# EAGLE design DSPC01_01 (EAGLE 6.5.0)
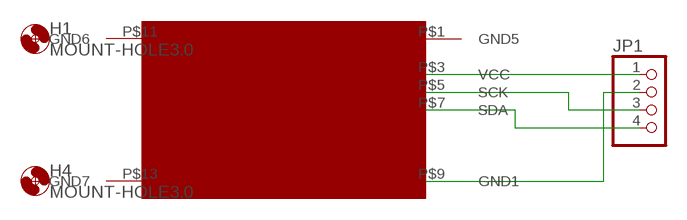
[diagram p0: schematic, sheet 1]

## Parts
H1  MOUNT-HOLE3.0  [3,0]
H4  MOUNT-HOLE3.0  [3,0]
JP1  PINHD-1X4/90  [1X04/90]
U$1  DSPC01  [DSPC01]

## Nets
N$1: JP1.2 U$1.P$9(GND1)
N$2: JP1.1 U$1.P$3(VCC)
N$3: JP1.3 U$1.P$5(SCK)
N$4: JP1.4 U$1.P$7(SDA)
Unconnected: U$1.P$1(GND5) U$1.P$11(GND6) U$1.P$13(GND7)

## Library data of the parts
H1 H4 = holes:MOUNT-HOLE: MOUNTING HOLE with drill center marker
JP1 = pinhead:PINHD-1X4: PIN HEADER
U$1 = DSPC01:DSPC01

## Board
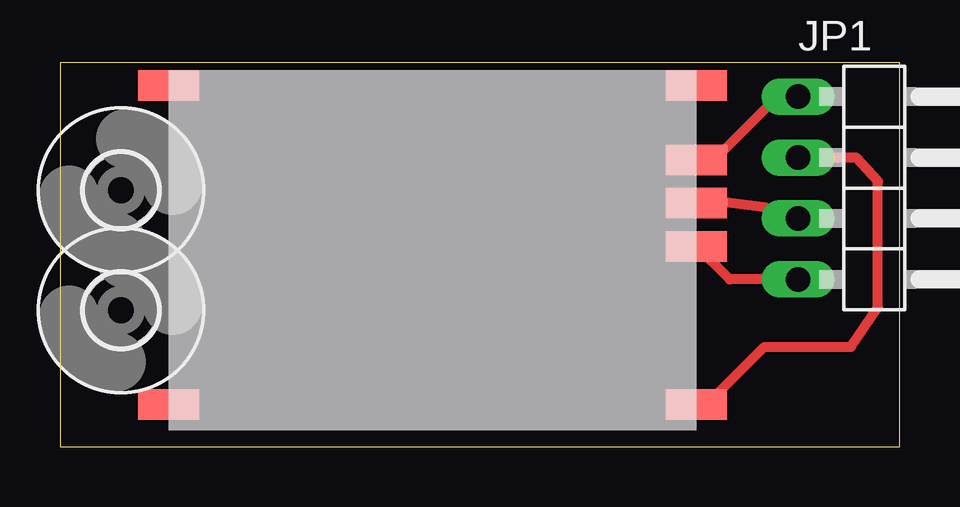
[diagram p1: board, top side]

Size 35 x 16 mm. Coordinates in mm from the lower left corner, seen from the top.
Outline: 0,0 35,0 35,16 0,16 0,0
Copper layers (1*16): Top 0.035mm / dielectric 1.5mm / Bottom 0.035mm
Design rules "default": minimum track width 10mil, minimum drill 24mil, track to track 8mil, track to pad 8mil, pad to pad 8mil, via to via 8mil, smd to smd 8mil, copper to edge 40mil, drill to drill 8mil, minimum pad ring 10mil, minimum via ring 8mil, stop-mask expansion 4mil, vias tented up to drill 0mil, thermal gap 10mil

### Footprints (pad centres in the part's own frame; a part is rotated, then mirrored left to right if it is on the bottom)
3,0 = hole 3: 0,0
1X04/90 = drill 1.016 long: 1 -3.81,-3.81; 2 -1.27,-3.81; 3 1.27,-3.81; 4 3.81,-3.81
DSPC01 = smd 2.54 x 1.27: P$1 22,14.365; P$3 22,11.265; P$5 22,9.465; P$7 22,7.665; P$9 22,1.065; P$11 0,14.365; P$13 0,1.065

### Placement (x,y rotation side)
H1  2.54,10.69 0 top
H4  2.54,5.69 0 top
JP1  34.58,10.78 270 top
U$1  4.54,0.69 0 top

### Tracks (layer width: path | path; a pad name or v marks a point on that pad's centre or on a via)
N$1
  Top 0.406: JP1.2 32.42,12.04 33.19,12.04 34.1,11.05 34.1,5.81 32.97,4.16 29.37,4.16 26.95,1.75 U$1.P$9
N$2
  Top 0.406: JP1.1 29.91,14.59 27.4,12.08 26.66,12.08 U$1.P$3
N$3
  Top 0.406: JP1.3 29.35,9.98 27.84,10.17 27.19,10.16 27.08,10.05 26.64,10.05 U$1.P$5
N$4
  Top 0.406: JP1.4 27.92,6.97 U$1.P$7